# EasyEDA Pro project ProProject_无线温湿度检测系统1_2024-10-27.epro, board PCB8
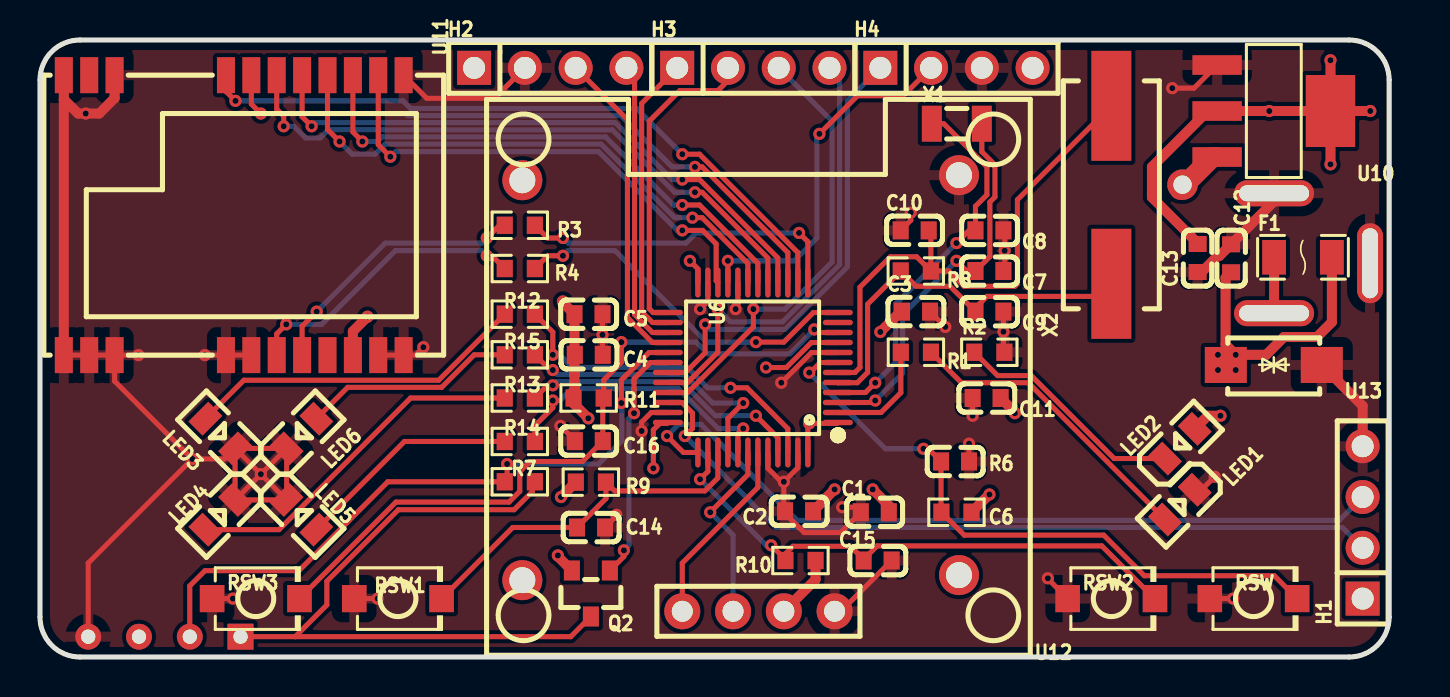
[diagram p15: board, top side]
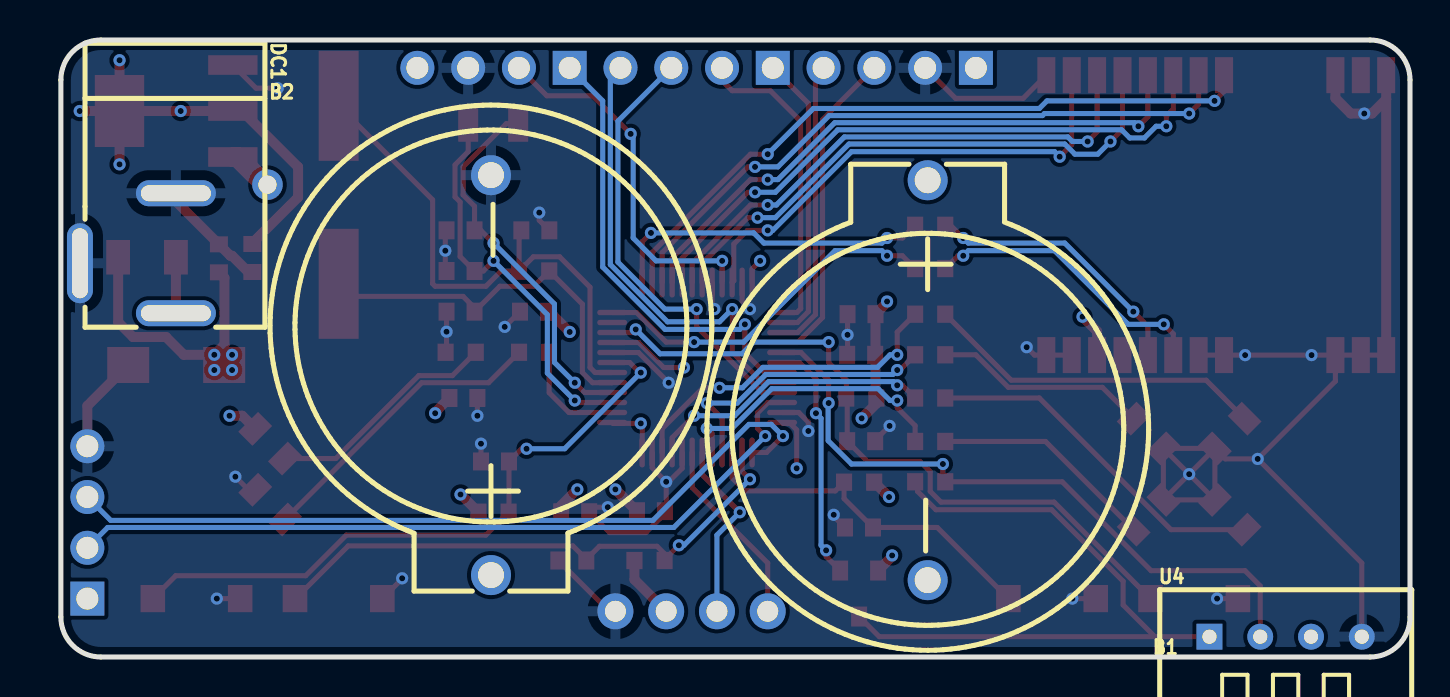
[diagram p16: board, bottom side, seen from below]

Outline 67.49 x 30.86 mm; copper layers: Top Layer, Inner1, Inner2, Bottom Layer. Coordinates in mm from the lower left corner of the outline.
Outline path: 0,28.86 0,2 arc(0.59,0.59) 2,0 65.49,0 arc(66.91,0.59) 67.49,2 67.49,28.86 arc(66.91,30.27) 65.49,30.86 2,30.86 arc(0.59,30.27) 0,28.86
Stack: Top Layer 0.035mm 外层铜厚1oz / Dielectric1 0.2104mm 7628 RC49% 8.6mil / Inner1 0.0152mm 内层铜厚 / Dielectric2 1.065mm 1.1mm H/HOZ 含铜 / Inner2 0.0152mm 内层铜厚 / Dielectric3 0.2104mm 7628 RC49% 8.6mil / Bottom Layer 0.035mm 外层铜厚1oz

## Design rules (mm)
template: JLCPCB Capability(Two Layers Board)
spacing copperThickness1oz (default): track to track 0.102, other pairs 0.152 to 0.3
spacing copperThickness2oz: track to track 0.203, other pairs 0.152 to 0.3
track width copperThickness1oz (default): min 0.127, default 0.254, max 2.54
track width copperThickness2oz: min 0.203, default 0.254, max 2.54
differential pair differentialPair (default): width min 0.127, default 0.254, max 2.54; gap min 0.152, default 0.152
via viaSize (default): diameter min 0.5, default 0.61, max 10; hole min 0.3, default 0.305, max 6.3

## Placement (name value [footprint] x y rotation side)
B1  BS-2-1  [BAT-TH_BS-2-1]  24.13 13.84 0 bottom
B2  BS-2-1  [BAT-TH_BS-2-1]  45.97 14.1 180 bottom
C1  100nF  [C0603]  41.76 7.24 0 top
C2  100nF  [C0603]  37.97 7.29 180 top
C3  100nF  [C0603]  43.83 17.27 0 top
C4  100nF  [C0603]  27.45 15.11 180 top
C5  100nF  [C0603]  27.44 17.14 180 top
C6  1uF  [C0603]  45.78 9.78 180 top
C7  20pF  [C0603]  47.5 19.3 180 top
C8  20pF  [C0603]  47.5 21.34 180 top
C9  20pF  [C0603]  47.5 17.27 180 top
C10  20pF  [C0603]  43.76 21.34 0 top
C11  100nF  [C0603]  47.36 12.95 180 top
C12  1uF  [C0603]  59.59 19.94 270 top
C13  1uF  [C0603]  57.91 19.95 90 top
C14  1uF  [C0603]  27.57 6.48 180 top
C15  1uF  [C0603]  41.91 4.83 180 top
C16  1uF  [C0603]  27.45 10.8 0 top
DC1  DC-005 2.0  [DC-IN-TH_DC-5520-1]  64.14 20.19 270 bottom
F1  nSMD010  [F1206]  63.18 19.99 0 top
H1  烧录  [HDR-TH_4P-P2.54-V-M]  66.17 6.73 90 top
H2  烧录  [HDR-TH_4P-P2.54-V-M]  25.53 29.46 0 top
H3  烧录  [HDR-TH_4P-P2.54-V-M]  35.69 29.46 0 top
H4  烧录  [HDR-TH_4P-P2.54-V-M]  45.85 29.46 0 top
LED1  NCD0805R1  [LED0805-R-RD]  57.02 7.62 225 top
LED2  NCD0805R1  [LED0805-R-RD]  57.02 10.67 45 top
LED3  NCD0805R1  [LED0805-R-RD]  9.02 11.18 135 top
LED4  NCD0805R1  [LED0805-R-RD]  9.02 7.11 225 top
LED5  NCD0805R1  [LED0805-R-RD]  13.08 7.11 315 top
LED6  NCD0805R1  [LED0805-R-RD]  13.08 11.18 45 top
NOREF  -  [Pad_e1651]  57.16 23.62 0 top
Q2  AO3401A  [SOT-23_L2.9-W1.3-P1.90-LS2.4-BR]  27.56 3.17 90 top
R1  510Ω  [R0603]  43.82 15.24 180 top
R2  510Ω  [R0603]  47.49 15.24 0 top
R3  200Ω  [R0603]  24 21.59 0 top
R4  200Ω  [R0603]  24 19.43 0 top
R6  10kΩ  [R0603]  45.85 7.24 0 top
R7  4.7kΩ  [R0603]  24 8.76 0 top
R8  1MΩ  [R0603]  43.81 19.3 180 top
R9  10kΩ  [R0603]  27.56 8.74 180 top
R10  10kΩ  [R0603]  38.04 4.83 0 top
R11  10kΩ  [R0603]  27.45 12.95 180 top
R12  4.7kΩ  [R0603]  24 17.14 180 top
R13  4.7kΩ  [R0603]  24 12.95 180 top
R14  4.7kΩ  [R0603]  24 10.78 180 top
R15  4.7kΩ  [R0603]  24 15.11 180 top
RSW  TS-1088R-02026  [SW-SMD_L3.9-W3.0-P4.45]  60.71 2.92 0 top
RSW1  TS-1088R-02026  [SW-SMD_L3.9-W3.0-P4.45]  17.91 2.92 0 top
RSW2  TS-1088R-02026  [SW-SMD_L3.9-W3.0-P4.45]  53.59 2.92 0 top
RSW3  TS-1088R-02026  [SW-SMD_L3.9-W3.0-P4.45]  10.8 2.92 0 top
U4  DHT11  [SENSOR-TH_DHT11]  6.22 1.02 180 bottom
U6  STM32F103C8T6  [LQFP-48_L7.0-W7.0-P0.50-LS9.0-BL]  35.66 14.48 90 top
U10  AMS1117-3.3  [SOT-223-4_L6.5-W3.5-P2.30-LS7.0-BR]  61.72 27.31 180 top
U11  E22-400M22S  [WIRELM-SMD_E22-400M22S]  9.69 22.1 270 top
U12  HS96L03W2C03  [OLED-TH_L27.8-W27.2-P2.54_C9900033791]  35.94 2.29 180 top
U13  SMAJ12CA  [SMA_L4.3-W2.7-LS5.1-BI]  61.72 14.61 180 top
X1  32.768kHz  [FC-135R_L3.2-W1.5]  45.87 26.67 0 top
X2  8MHz  [CRYSTAL-SMD_L11.5-W4.8-LS12.7]  53.59 23.11 90 top

## Footprints (pads in the part's own frame, mm; a bottom-side part is the same pattern mirrored in y, then rotated)
BAT-TH_BS-2-1
  round 2 hole 1.3: 1(0,-10) 2(0,10)
C0603
  rect 0.8x0.9 smd: 1(-0.7,0) 2(0.7,0)
CRYSTAL-SMD_L11.5-W4.8-LS12.7
  rect 5.5x2 smd: 1(-4.45,0) 2(4.45,0)
DC-IN-TH_DC-5520-1
  oval 4x1.3 hole 3.5x0.8: 2(0.5,-2.4)
  oval 1.3x4 hole 0.8x3.5: 3(-3,2.4) 4(3,2.4)
F1206
  rect 1.19x1.728 smd: 1(-1.445,0) 2(1.445,0)
FC-135R_L3.2-W1.5
  rect 1x1.8 smd: 1(-1.25,0) 2(1.25,0)
HDR-TH_4P-P2.54-V-M
  rect 1.7x1.7 hole 1.1: 1(-3.81,0)
  round 1.7 hole 1.1: 2(-1.27,0) 3(1.27,0) 4(3.81,0)
LED0805-R-RD
  rect 1x1.399 smd: 1(1.05,0) 2(-1.05,0)
LQFP-48_L7.0-W7.0-P0.50-LS9.0-BL
  oval 0.27x1.5 smd: 1(-2.75,-4.25) 2(-2.25,-4.25) 3(-1.75,-4.25) 4(-1.25,-4.25) 5(-0.75,-4.25) 6(-0.25,-4.25) 7(0.25,-4.25) 8(0.75,-4.25) 9(1.25,-4.25) 10(1.75,-4.25) 11(2.25,-4.25) 12(2.75,-4.25) 25(2.75,4.25) 26(2.25,4.25) 27(1.75,4.25) 28(1.25,4.25) 29(0.75,4.25) 30(0.25,4.25) 31(-0.25,4.25) 32(-0.75,4.25) 33(-1.25,4.25) 34(-1.75,4.25) 35(-2.25,4.25) 36(-2.75,4.25)
  oval 1.5x0.27 smd: 13(4.25,-2.75) 14(4.25,-2.25) 15(4.25,-1.75) 16(4.25,-1.25) 17(4.25,-0.75) 18(4.25,-0.25) 19(4.25,0.25) 20(4.25,0.75) 21(4.25,1.25) 22(4.25,1.75) 23(4.25,2.25) 24(4.25,2.75) 37(-4.25,2.75) 38(-4.25,2.25) 39(-4.25,1.75) 40(-4.25,1.25) 41(-4.25,0.75) 42(-4.25,0.25) 43(-4.25,-0.25) 44(-4.25,-0.75) 45(-4.25,-1.25) 46(-4.25,-1.75) 47(-4.25,-2.25) 48(-4.25,-2.75)
OLED-TH_L27.8-W27.2-P2.54_C9900033791
  round 1.8 hole 1.05: 1(-3.81,0) 2(-1.27,0) 3(1.27,0) 4(3.81,0)
Pad_e1651
  round 1.524 hole 0.914: 49(0,0)
R0603
  rect 0.806x0.864 smd: 1(-0.753,0) 2(0.753,0)
SENSOR-TH_DHT11
  rect 1.296x1.296 hole 0.711: 1(-3.81,0)
  round 1.296 hole 0.711: 2(-1.27,0) 3(1.27,0) 4(3.81,0)
SMA_L4.3-W2.7-LS5.1-BI
  rect 2.1x1.8 smd: 1(-2.4,0) 2(2.4,0)
SOT-23_L2.9-W1.3-P1.90-LS2.4-BR
  rect 1x0.8 smd: 1(1.15,-0.95) 2(1.15,0.95) 3(-1.15,0)
SOT-223-4_L6.5-W3.5-P2.30-LS7.0-BR
  rect 2.47x0.98 smd: 1(2.835,-2.3) 2(2.835,0) 3(2.835,2.3)
  rect 2.47x3.6 smd: 4(-2.835,0)
SW-SMD_L3.9-W3.0-P4.45
  rect 1.23x1.36 smd: 1(-2.185,0) 2(2.185,0)
WIRELM-SMD_E22-400M22S
  rect 1.8x0.9 smd: 1(7,-8.5) 2(7,-7.23) 3(7,-5.96) 4(7,-0.39) 5(7,0.88) 6(7,2.15) 7(7,3.42) 8(7,4.69) 9(7,5.96) 10(7,7.23) 11(7,8.5) 12(-7,8.5) 13(-7,7.23) 14(-7,5.96) 15(-7,4.69) 16(-7,3.42) 17(-7,2.15) 18(-7,0.88) 19(-7,-0.39) 20(-7,-5.96) 21(-7,-7.23) 22(-7,-8.5)

## Nets
As in the schematic, except:
12V&B_VCC: B1.1 C12.2 F1.2 NOREF.49 U10.3 U13.2

Pads without a net: U4 3; U6 11; U11 8 21

## Via types
v1: diameter 0.61, hole 0.305, Top Layer to Bottom Layer, 102 vias

## Routing (per net, layer and track width the routed paths; a pad name or vN(x,y) marks a point on that pad's centre or on a via; arc(x,y) is an arc through that point)
12V&B_VCC: length 64.1
  Top Layer w0.5: F1.2 64.63,16.75 63.88,16 62.23,16 61.34,15.11 v1(59.82,15.11) 59.31,15.62 59.31,18.96 59.59,19.24
  Top Layer w1: 57.02,23.37 58.66,25 58.89,25
  Inner2 w1: 50.88,17.19 52.28,15.8 58.25,15.8 v1(58.93,15.11) 59.06,15.11 v1(59.82,14.35) ; 50.88,17.19 49.4,18.67 31.24,18.67 26.07,23.84 B1.1 ; 50.88,17.19 57.02,23.34 57.02,23.37
  vias: v1(58.93,14.35)
GND: length 330.5
  Top Layer w0.254: C15.1 40.06,2.29 U12.1 ; U6.8 38.6,15.23 v1(37.08,13.72) ; U6.47 37.91,9.46 v1(37.21,8.76) ; v1(28.83,7.11) 28.83,7.04 28.27,6.48 ; 37.21,7.35 37.27,7.29 ; 37.21,7.35 37.21,7.24 38.23,6.22 40.05,6.22 C1.1 40.81,7.49 v1(40.13,7.49) ; 37.21,7.35 v1(37.21,8.76) ; C8.1 48.26,21.27 v1(48.26,20.32) 48.26,19.37 C7.1 ; LED5.2 LED4.2 ; LED5.2 v1(11.05,9.14) ; LED5.2 LED6.2 ; LED4.2 LED3.2 ; LED4.2 v1(11.05,9.14) ; LED3.2 v1(11.05,9.14) ; LED3.2 9.23,9.91 v1(7.62,9.91) ; LED3.2 LED6.2 ; RSW3.1 v1(9.65,2.92) ; C4.1 28.14,15.13 v1(28.14,16.11) 28.14,17.14 ; RSW2.1 50.42,3.91 v1(50.42,3.94) ; U11.3 v1(4.92,15.1) v1(8.25,15.1) U11.4 U11.5 ; U11.3 U11.2 U11.1 ; U11.3 3.73,13.79 v1(7.62,9.91) ; v1(37.21,8.76) 37.08,8.76 36.41,9.44 U6.44 ; 58.8,9.02 v1(58.76,9.02) 58.11,8.36 LED1.2 ; v1(11.05,9.14) LED6.2 ; v1(46.48,10.67) C6.1 ; RSW.1 v1(59.69,2.92) ; v1(56.64,28.45) 57.73,28.45 U10.1 ; C3.2 v1(45.29,16.51) 45.34,16.51 ; v1(7.62,9.91) 2.41,4.7 U4.4 ; v1(46.66,12.06) C11.2 ; C9.1 v1(48.2,16.27) 48.2,15.29 R2.2 ; v1(26.03,11.56) 26.75,10.84 C16.1 ; v1(43.56,22.22) 43.56,21.84 C10.1 ; v1(34.8,17.4) 34.91,17.51 U6.20 ; U6.35 30.58,12.23 30.1,11.75 v1(30.1,11.3) ; H2.2 22.73,27.94 19.35,27.94 18.19,29.1 ; U11.10 18.78,15.1 v1(19.18,15.49) ; U6.23 33.41,17.79 v1(33.02,17.4) ; RSW1.1 v1(16.89,2.92)
  Top Layer w0.5: H1.4 66.17,12.56 U13.1 ; 1.19,27.89 U11.1 ; 1.19,27.89 U11.22 ; 1.19,27.89 1.91,27.18 v1(2.29,27.18) 2.96,27.18 3.73,27.95 U11.20 ; C13.1 58.12,19.25 58.93,20.07 59.01,20.07 C12.1 61.74,22.79 DC1.3
  Inner1 w0.254: H2.2 28.7,25.02 28.7,16.67 ; v1(28.83,7.11) 28.83,8.76 26.29,11.3 ; 28.7,16.67 v1(28.14,16.11) 28.14,14.68 26.92,13.46 26.92,12.45 v1(26.03,11.56) ; 28.7,16.67 29.43,17.4 v1(33.02,17.4) 33.66,18.03 33.66,18.29 34.54,18.29 34.8,18.03 v1(34.8,17.4) 34.8,15.49 34.93,15.37 34.93,14.61 35.94,13.59 36.96,13.59 v1(37.08,13.72) ; v1(37.08,13.72) 37.08,8.89 v1(37.21,8.76) 39.75,6.22 U12.1 40.13,2.67 v1(40.13,7.49) ; v1(37.08,13.72) 38.86,15.49 43.56,15.49 43.94,15.11 45.29,16.46 v1(45.29,16.51) 47.96,16.51 v1(48.2,16.27) ; 26.29,11.3 v1(30.1,11.3) ; 26.29,11.3 v1(26.03,11.56) ; v1(8.25,15.1) 18.78,15.1 ; 18.78,15.1 12.83,9.14 v1(11.05,9.14) 11.05,4.32 v1(9.65,2.92) v1(16.89,2.92) ; 18.78,15.1 v1(19.18,15.49) 22.99,11.68 25.91,11.68 v1(26.03,11.56) ; v1(56.64,28.45) 61.74,23.35 DC1.3 61.74,20.08 61.47,19.81 66.42,19.81 DC1.2 66.17,19.32 H1.4 64.64,9.02 v1(58.76,9.02) ; B2.2 44.1,22.22 v1(43.56,22.22) ; B2.2 47.12,25.24 47.12,29.46 ; B2.2 48.26,21.81 v1(48.26,20.32) 48.26,16.33 v1(48.2,16.27) ; v1(48.2,16.27) 48.2,13.61 v1(46.66,12.06) 46.66,10.85 v1(46.48,10.67) 46.74,10.67 50.42,6.98 v1(50.42,3.94) 53.68,3.94 v1(58.76,9.02) ; v1(58.76,9.02) 58.76,3.85 v1(59.69,2.92)
VCC: length 228.9
  Top Layer w0.254: U6.36 31.37,11.68 31.01,11.68 30.68,11.36 v1(30.68,9.44) ; U6.1 39.87,11.68 v1(38.48,11.68) 38.41,11.61 U6.48 ; U6.24 32.91,19.41 v1(32.51,19.81) ; v1(36.32,14.48) 37.34,14.48 38.59,15.73 U6.9
  Top Layer w0.5: C3.1 43.05,17.27 v1(42.04,16.26) ; LED2.1 58.42,12.06 v1(59.06,12.06) ; 26.74,15.13 C5.2 26.16,17.72 v1(26.16,17.78) ; 26.74,15.13 C4.2 ; 26.74,15.13 26.74,13 26.69,12.95 26.69,12.68 v1(27.43,11.94) ; C1.2 42.46,7.58 v1(41.66,8.38) ; v1(25.91,5.08) 25.91,5.03 Q2.2 ; 64.56,27.31 v1(64.56,24.64) ; 64.56,27.31 v1(61.5,27.31) U10.2 58.42,27.31 55.63,24.51 55.63,22.99 57.91,20.7 C13.2 ; 64.56,27.31 v1(64.56,29.84) ; 64.56,27.31 v1(66.55,27.31) ; C2.1 39.37,7.99 39.37,8 v1(39.75,8.38) ; R10.2 38.8,3.87 U12.2 ; R9.2 v1(26.06,8) 26.03,8 ; U11.9 15.65,16.29 v1(16.38,17.02) ; v1(48.77,12.19) 48.77,12.24 C11.1 ; R6.2 47.49,8.13 v1(47.5,8.13)
  Inner2 w0.5: v1(59.06,12.06) 58.93,12.19 v1(48.77,12.19) 47.5,10.92 v1(47.5,8.13) ; v1(59.06,12.06) 60.83,13.84 64.26,13.84 65.02,14.61 65.02,17.53 60.96,21.59 58.93,21.59 58.93,24.74 v1(61.5,27.31) 59.34,29.46 H4.4 ; v1(59.06,12.06) 63.5,7.62 63.5,5.46 66.04,2.92 H1.1 ; v1(32.51,19.81) 25.65,26.67 24.51,26.67 H2.1 21.72,22.35 v1(16.38,17.02) 25.4,17.02 v1(26.16,17.78) 27.43,16.51 v1(27.43,11.94) ; 27.43,9.37 27.5,9.44 v1(30.68,9.44) ; 27.43,9.37 v1(26.06,8) 25.91,7.85 v1(25.91,5.08) ; 27.43,9.37 v1(27.43,11.94) ; v1(47.5,8.13) 47.24,8.38 v1(41.66,8.38) v1(39.75,8.38) 38.48,9.65 v1(38.48,11.68) ; v1(47.5,8.13) 47.5,2.16 46.23,0.89 38.61,0.89 U12.2 ; v1(27.43,11.94) 29.21,10.16 36.96,10.16 v1(38.48,11.68) ; v1(38.48,11.68) 37.72,11.68 35.94,13.46 35.94,14.1 v1(36.32,14.48) 37.08,15.24 41.02,15.24 v1(42.04,16.26)
DHT11_VCC: length 34
  Top Layer w0.254: 12.77,1.02 26.55,1.02 Q2.3 ; 12.77,1.02 U4.1 ; 12.77,1.02 14.35,2.6 14.35,3.79 17.93,7.37 23.72,7.37 24.64,8.29 24.64,8.64 R7.2
NRST: length 32.2
  Top Layer w0.254: U6.7 39.03,14.73 38.53,14.22 v1(38.48,14.22) ; v1(44.2,10.41) 44.44,10.41 C6.2 45.08,7.26 R6.1 46.24,6.1 53.21,6.1 55.25,4.06 61.75,4.06 RSW.2
  Bottom Layer w0.254: v1(38.48,14.22) 42.29,10.41 v1(44.2,10.41)
PA2/USART2_TX: length 18
  Top Layer w0.254: v1(35.81,15.75) 37.21,15.75 38.69,17.23 U6.12 ; R4.2 25.39,20.07 v1(26.16,20.07)
  Bottom Layer w0.254: v1(35.81,15.75) 33.34,15.75 28.76,20.32 26.42,20.32 v1(26.16,20.07)
PA3/USART2_RX: length 16.5
  Top Layer w0.254: U6.13 38.41,20.77 v1(37.97,21.21) ; v1(26.16,20.95) 25.39,20.95 R3.2
  Bottom Layer w0.254: v1(26.16,20.95) 26.42,20.7 32.32,20.7 32.83,21.21 v1(37.97,21.21)
PA4/SPI1_NSS: length 34.3
  Top Layer w0.254: U11.19 9.3,28.29 v1(9.78,27.81) ; v1(32.13,25.15) 32.99,25.15 37.91,20.23 U6.14
  Bottom Layer w0.254: v1(9.78,27.81) 18.16,27.81 18.54,27.43 29.84,27.43 v1(32.13,25.15)
PA5/SPI1_SCK: length 32.9
  Top Layer w0.254: U11.18 10.57,27.65 v1(11.05,27.18) ; v1(32.77,24.51) 33.12,24.51 37.41,20.22 U6.15
  Bottom Layer w0.254: v1(32.77,24.51) 31.62,24.51 29.06,27.08 18.39,27.08 18.29,27.18 v1(11.05,27.18)
PA6/SPI1_MISO: length 30.2
  Top Layer w0.254: v1(32.13,23.88) 32.99,23.88 36.91,19.96 U6.16 ; U11.16 13.11,27.02 v1(13.59,26.54)
  Bottom Layer w0.254: v1(13.59,26.54) 13.77,26.72 28.78,26.72 31.62,23.88 v1(32.13,23.88)
PA7/SPI1_MOSI: length 31.2
  Top Layer w0.254: v1(12.19,26.54) 12.19,27.05 11.84,27.4 U11.17 ; v1(32.77,23.24) 33.12,23.24 36.41,19.95 U6.17
  Bottom Layer w0.254: v1(12.19,26.54) 12.7,26.54 13.28,25.96 14.02,25.96 14.43,26.36 28.63,26.36 31.75,23.24 v1(32.77,23.24)
PA8/DATA: length 33.6
  Top Layer w0.254: v1(23.37,9.65) 23.37,8.88 R7.1 17.4,8.76 12.95,4.32 8.25,4.32 7.49,3.56 U4.2 ; U6.29 30.47,15.23 29.08,13.84 v1(29.08,12.7)
  Bottom Layer w0.254: v1(29.08,12.7) 29.11,12.67 29.11,10.82 27.94,9.65 v1(23.37,9.65)
PA9/DHT11_CONTROL_VCC: length 12.1
  Top Layer w0.254: v1(29.21,5.33) 29.21,5.03 Q2.1 ; v1(29.72,12.19) 29.72,13.91 30.53,14.73 U6.30
  Bottom Layer w0.254: v1(29.21,5.33) 29.46,5.59 29.46,11.94 v1(29.72,12.19)
PA10/OUT: length 22.8
  Top Layer w0.254: v1(33.27,16.64) 33.27,15.21 32.29,14.23 U6.31
  Bottom Layer w0.254: v1(33.27,16.64) 33.53,16.38 37.27,16.38 40.39,19.5 40.39,27.81 H4.1
PA11/OUT: length 22.9
  Top Layer w0.254: U6.32 32.4,13.73 33.91,15.24 v1(33.91,17.4)
  Bottom Layer w0.254: v1(33.91,17.4) 34.54,16.76 37.14,16.76 40,19.63 40,28.96 H3.4
PA12/OUT: length 22.3
  Top Layer w0.254: v1(35.69,17.4) 35.69,16.51 32.41,13.23 U6.33
  Bottom Layer w0.254: 36.96,29.46 39.62,26.8 39.62,19.75 37.28,17.4 v1(35.69,17.4)
PA15/KEY2: length 28.3
  Top Layer w0.254: 41.21,4.88 C15.2 ; 41.21,4.88 40.55,5.54 37.67,5.54 37.29,5.16 37.29,4.95 37.21,4.95 v1(36.58,5.59) ; 41.21,4.88 41.88,5.56 53.12,5.56 55.78,2.89 55.78,2.54 ; U6.38 33.41,9.28 v1(33.02,8.89)
  Bottom Layer w0.254: v1(33.02,8.89) 36.32,5.59 v1(36.58,5.59)
PB0/BUSY: length 27
  Top Layer w0.254: U11.14 15.65,26.26 v1(16.13,25.78) ; U6.18 35.91,19.69 32.99,22.61 v1(32.13,22.61)
  Bottom Layer w0.254: v1(16.13,25.78) 16.89,25.78 17.12,26.01 28.3,26.01 31.7,22.61 v1(32.13,22.61)
PB1/NRST: length 27.9
  Top Layer w0.254: v1(32.64,21.97) 33.12,21.97 35.41,19.68 U6.19 ; U11.15 14.38,26.38 v1(14.99,25.78)
  Bottom Layer w0.254: v1(14.99,25.78) 15.62,25.15 16.76,25.15 17.27,25.65 28.07,25.65 31.75,21.97 v1(32.64,21.97)
PB3/KEY1: length 18.4
  Top Layer w0.254: RSW1.2 23.65,6.48 C14.2 28.31,7.92 R9.1 28.75,8.31 33.26,8.31 33.91,8.95 33.91,10.23 U6.39
PB4/DEBUG4: length 14.3
  Top Layer w0.254: 24.76,14.99 R15.1 25.52,14.35 v1(25.65,14.35) ; U6.40 34.41,11.93 v1(35.18,12.7)
  Bottom Layer w0.254: v1(35.18,12.7) 33.66,12.7 32.22,14.13 25.88,14.13 v1(25.65,14.35)
PB5/DEBUG3: length 14.3
  Top Layer w0.254: U6.41 34.91,11.16 v1(35.18,11.43) ; v1(25.65,12.83) 25.65,12.47 24.76,11.57 R14.1
  Bottom Layer w0.254: v1(25.65,12.83) 26.01,12.83 26.6,13.42 31.93,13.42 33.92,11.43 v1(35.18,11.43)
PB6/I2C1_SCL: length 9.2
  Top Layer w0.254: U6.42 35.41,9.12 v1(33.53,7.24)
  Bottom Layer w0.254: v1(33.53,7.24) 34.67,6.1 U12.3
PB7/I2C1_SDA: length 9.5
  Top Layer w0.254: U12.4 32.13,4.7 35.91,8.48 U6.43
PB8/DEBUG2: length 14.4
  Top Layer w0.254: v1(25.65,13.59) 25.39,13.59 R13.1 ; v1(35.81,12.06) 36.91,10.97 U6.45
  Bottom Layer w0.254: v1(35.81,12.06) 33.79,12.06 32.08,13.77 25.84,13.77 v1(25.65,13.59)
PB9/DEBUG1: length 16.9
  Top Layer w0.254: v1(34.54,13.46) 35.37,13.46 37.41,11.42 U6.46 ; v1(25.65,15.11) 25.65,16.25 R12.1
  Bottom Layer w0.254: v1(25.65,15.11) 26.01,15.11 26.64,14.49 32.37,14.49 33.4,13.46 v1(34.54,13.46)
PB10/OUT: length 18.2
  Top Layer w0.254: H4.2 43.18,28.07 40.89,28.07 v1(38.99,26.16) ; U6.21 v1(34.41,19.81)
  Bottom Layer w0.254: v1(34.41,19.81) 37.72,19.81 38.86,20.95 38.86,26.03 v1(38.99,26.16)
PB11/DIO1: length 24.6
  Top Layer w0.254: U6.22 33.83,18.81 33.83,20.66 33.15,21.34 v1(32.13,21.34) ; U11.13 16.92,25.62 v1(17.53,25.02)
  Bottom Layer w0.254: v1(32.13,21.34) 31.88,21.34 27.94,25.27 17.78,25.27 v1(17.53,25.02)
PB12/OUT: length 15.8
  Top Layer w0.254: U6.25 30.67,17.23 30.48,17.42 30.48,26.8 32,28.32 33.91,28.32 34.42,28.83 H3.2
PB13/OUT: length 14.5
  Top Layer w0.254: U6.26 30.64,16.73 30.1,17.27 30.1,27.69 H3.1
PB14/OUT: length 14.5
  Top Layer w0.254: U6.27 30.64,16.23 29.74,17.12 29.74,29.06 H2.4
PB15/OUT: length 16.1
  Top Layer w0.254: U6.28 30.64,15.73 29.39,16.98 29.39,26.87 H2.3
PC13/TAMPER-RTC: length 5.6
  Top Layer w0.254: R1.2 43.06,13.22 42.07,12.23 U6.2
PC14/OSC32_IN: length 19.8
  Top Layer w0.254: X1.2 47.12,25.27 47.77,24.61 47.77,23.01 47.52,22.75 47.52,20.02 C7.2 46.35,19.3 v1(45.85,19.81) ; v1(41.78,12.83) 41.68,12.73 U6.3
  Bottom Layer w0.254: v1(41.78,12.83) 43.16,14.2 43.16,17.12 v1(45.85,19.81)
PC15/OSC32_OUT: length 19
  Top Layer w0.254: v1(45.85,20.7) 46.48,21.34 C8.2 46.8,22.54 47.37,23.11 47.37,24.51 45.21,26.67 X1.1 ; U6.4 41.29,13.23 v1(41.78,13.72)
  Bottom Layer w0.254: v1(41.78,13.72) 42.8,14.73 42.8,17.65 v1(45.85,20.7)
PD0/OSC_IN: length 19.5
  Top Layer w0.254: X2.1 52.96,18.03 47.37,18.03 46.8,17.46 C9.2 45.53,18.54 43.82,18.54 R8.2 41.4,17.65 41.4,14.23 40.89,13.72 39.92,13.72 U6.5
PD1/OSC_OUT: length 27.3
  Top Layer w0.254: U6.6 40.77,14.23 41.02,14.48 41.02,18.5 42.54,20.02 43.86,20.02 R8.1 ; R8.1 44.57,21.23 C10.2 ; R8.1 45.47,19.3 46.23,18.54 48.77,18.54 48.9,18.67 48.9,22.86 X2.2
SWDCLK: length 39.4
  Top Layer w0.254: v1(31.37,11.05) 32.19,10.23 U6.37
  Bottom Layer w0.254: H1.3 65,6.83 37.87,6.83 33.07,11.63 31.95,11.63 v1(31.37,11.05)
SWDIO: length 39
  Top Layer w0.254: v1(32.26,11.05) 32.64,11.43 32.64,12.2 32.11,12.73 U6.34
  Bottom Layer w0.254: H1.2 65.15,6.48 36.83,6.48 v1(32.26,11.05)
WKUP_KEY: length 36
  Top Layer w0.254: RSW3.2 17.81,7.75 23.46,7.75 24,8.29 24,9.27 24.51,9.78 27.14,9.78 C16.2 28.15,12.91 R11.1 28.2,13.85 29.08,14.73 v1(29.08,15.75) ; v1(38.74,16.38) 38.89,16.23 U6.10
  Bottom Layer w0.254: v1(38.74,16.38) 37.52,15.16 33.42,15.16 32.83,15.75 v1(29.08,15.75)
$1N1536: length 11.7
  Top Layer w0.254: LED2.2 53.74,9.93 49.59,14.07 47.91,14.07 R2.1
$1N1721: length 14.6
  Top Layer w0.254: v1(12.32,16.64) 11.84,16.16 U11.6 ; v1(22.35,20.07) 22.61,20.07 R4.1
  Bottom Layer w0.254: v1(12.32,16.64) 14.1,16.64 17.78,20.32 22.1,20.32 v1(22.35,20.07)
$1N1727: length 13.7
  Top Layer w0.254: R3.1 22.99,21.59 v1(22.35,20.95) ; v1(13.84,17.27) 13.11,16.54 U11.7
  Bottom Layer w0.254: v1(22.35,20.95) 22.1,20.7 17.27,20.7 v1(13.84,17.27)
$1N3357: length 17.7
  Top Layer w0.254: LED4.1 11.96,6.37 18.54,12.95 R13.2
$1N4011: length 21.9
  Inner2 w1: B2.1 45.72,3.84 B1.2
$1N22011: length 15.2
  Top Layer w0.254: LED1.1 49.44,13.72 46.1,13.72 R1.1
$1N22868: length 17.1
  Top Layer w0.254: LED3.1 10.2,13.84 19.95,13.84 R12.2
$1N22951: length 11.3
  Top Layer w0.254: LED5.1 18.23,10.78 R14.2
$1N22990: length 10.7
  Top Layer w0.254: LED6.1 15.39,13.49 20.09,13.49 21.72,15.11 R15.2
$1N24718: length 2.8
  Top Layer w0.5: DC1.4 F1.1

## Copper pours and planes (outline as drawn; the poured copper is in the pictures)
GND on Top Layer: 0,30.78 67.56,30.78 67.56,-0.09 0,-0.09
GND on Bottom Layer: -0.13,30.8 67.44,30.8 67.44,-0.06 -0.13,-0.06
GND on Inner1: 0,30.78 67.56,30.78 67.56,-0.09 0,-0.09
GND on Inner2: -0.13,30.86 67.44,30.86 67.44,0 -0.13,0
VCC on Inner2: 19.98,30.73 19.98,22.61 15.11,17.74 15.11,15.88 16.33,14.65 24.96,14.65 25.53,14.09 25.53,10.16 21.96,6.59 21.96,-0.13 48.16,-0.13 49.4,1.11 49.4,8.64 49.28,8.76 50.67,10.16 57.66,10.16 60.38,7.44 60.58,7.44 60.58,4.43 60.48,4.33 64.94,-0.13 67.44,-0.13 67.44,30.73 47.68,30.73 47.68,27.63 49.91,25.4 49.91,21.7 48.53,20.32 35.49,20.32 25.08,30.73
